# EAGLE schematic blahblahVCA (EAGLE 9.6.2)
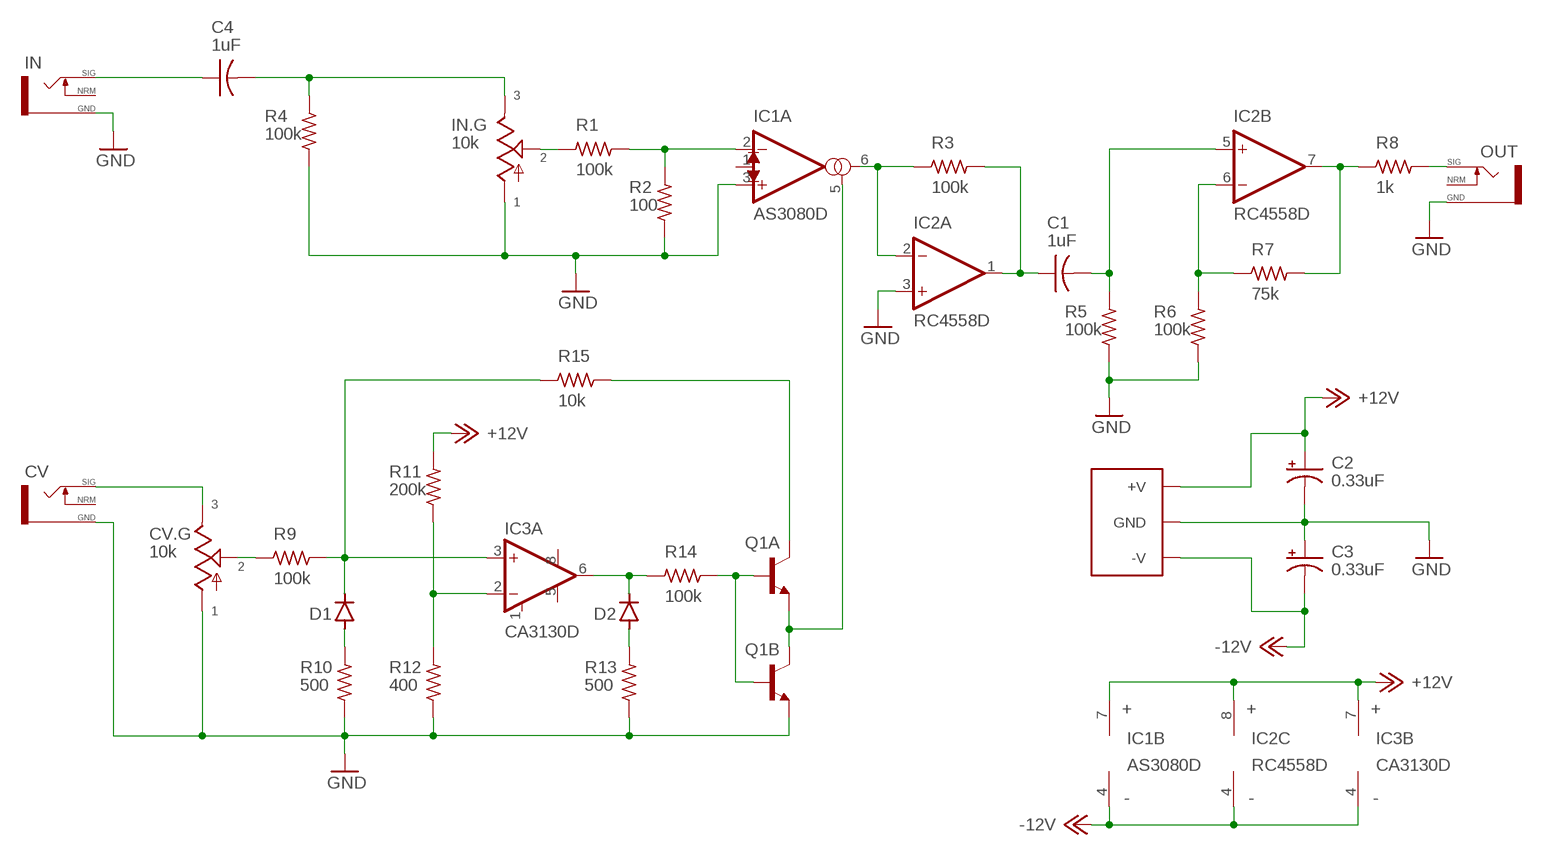
[diagram p0: schematic, sheet 1]

## Parts
C1  1uF  C-05  [C05]
C2  0.33uF  CPOL-E025  [E025]
C3  0.33uF  CPOL-E025  [E025]
C4  1uF  C-05  [C05]
CV  MONO301M  [PJ301M]
CV.G  10k  PALPHA  [ALPHA-VERT]
D1  1N914  [DO35-7]
D2  1N914  [DO35-7]
IC1  AS3080D  [DIL08]
IC2  RC4558D  [DIL08]
IC3  CA3130D  [DIL08]
IN  MONO301M  [PJ301M]
IN.G  10k  PALPHA  [ALPHA-VERT]
OUT  MONO301M  [PJ301M]
Q1  BCM847DS  [SOT-23-6]
R1  100k  R-1206  [R1206]
R2  100  R-1206  [R1206]
R3  100k  R-1206  [R1206]
R4  100k  R-1206  [R1206]
R5  100k  R-1206  [R1206]
R6  100k  R-1206  [R1206]
R7  75k  R-1206  [R1206]
R8  1k  R-1206  [R1206]
R9  100k  R-1206  [R1206]
R10  500  R-1206  [R1206]
R11  200k  R-1206  [R1206]
R12  400  R-1206  [R1206]
R13  500  R-1206  [R1206]
R14  100k  R-1206  [R1206]
R15  10k  R-1206  [R1206]
U$1  10PIN-PWR  [10PIN-HEADER]

## Nets
+12V: C2.+ IC1.7(B:V+) IC2.8(C:V+) IC3.7(B:V+) R11.2 U$1.9(+V) U$1.10(+V)
-12V: C3.- IC1.4(B:V-) IC2.4(C:V-) IC3.4(B:V-) U$1.1(-V) U$1.2(-V)
GND: C2.- C3.+ CV.G.1 CV.SLV(SLEEVE-GND) IC1.3(A:NON-INVERTING(+)) IC2.3(A:NON-INVERTING(+)) IN.G.1 IN.SLV(SLEEVE-GND) OUT.SLV(SLEEVE-GND) Q1.4(B:E) R2.1 R4.1 R5.1 R6.1 R10.1 R12.1 R13.1 U$1.3(GND) U$1.4(GND) U$1.5(GND) U$1.6(GND) U$1.7(GND) U$1.8(GND)
N$2: IC1.2(A:INVERTING(-)) R1.2 R2.2
N$3: C1.1 IC2.1(A:OUT) R3.2
N$4: IC1.6(A:OUT) IC2.2(A:INVERTING(-)) R3.1
N$5: IN.G.2 R1.1
N$6: C1.2 IC2.5(B:NON-INVERTING(+)) R5.2
N$7: IC2.6(B:INVERTING(-)) R6.2 R7.1
N$8: IC2.7(B:OUT) R7.2 R8.1
N$9: OUT.TIP(TIP-SIG) R8.2
N$10: CV.G.2 R9.1
N$11: D1.C IC3.3(A:NON-INVERTING(+)) R9.2 R15.1
N$12: D1.A R10.2
N$13: IC3.2(A:INVERTINGA(-)) R11.1 R12.2
N$14: D2.C IC3.6(A:OUT) R14.1
N$15: D2.A R13.2
N$16: Q1.2(A:B) Q1.5(B:B) R14.2
N$17: IC1.5(A:I-BIAS) Q1.1(A:E) Q1.3(B:C)
N$18: Q1.6(A:C) R15.2
N$19: C4.1 IN.TIP(TIP-SIG)
N$20: C4.2 IN.G.3 R4.2
N$21: CV.G.3 CV.TIP(TIP-SIG)
Unconnected: CV.SW(SWITCH-NORM) IC1.1(A:D-BIAS) IC3.1(A:NULL(1)) IC3.5(A:NULL(5)) IC3.8(A:STRB) IN.SW(SWITCH-NORM) OUT.SW(SWITCH-NORM)

## Library data of the parts
C1 C4 = wb-rcl:C
C2 C3 = wb-rcl:CPOL
CV IN OUT = wb-jacks:MONO
CV.G IN.G = wb-potswitch:P
D1 D2 = wb-diode:1N914
IC1 = wb-ota:AS3080: http://www.alfarzpp.lv/eng/sc/AS3080E.pdf
IC2 = wb-opamps:RC4558: Dual General-Purpose Operational Amplifier https://www.ti.com/lit/ds/symlink/rc4558.pdf
IC3 = wb-opamps:CA3130: BiMOS Op-Amp. Applications: • Sample-Hold Amplifiers • Long-Duration Timers/Monostables • High-Input-Impedance Comparators (Ideal Interface with Digital CMOS) • High-Input-Impedance Wideband Amplifiers https://www.renesas.com/us/en/document/dst/ca3130-ca3130a-datasheet
Q1 = wb-transistors:BCM847DS
R1-R15 = wb-rcl:R
U$1 = wb-power:10PIN-PWR